# Altium schematic sheet CE842170260_SHEET1.SchDoc
size Tabloid; Revision: P; SheetNumber: 1; SheetTotal: 1; PageSetup: Record=PageOptions|CenterHorizontal=True|CenterVertical=True|PrintScale=0.75|XCorrection=1.00|YCorrection=1.00|PrintKind=0|BorderSize=5000000|LeftOffset=0|BottomOffset=0|Orientation=2|PaperLength=1000|PaperWidth=1000|Scale=100|PaperSource=7|PrintQuality=-4|MediaType=1|DitherType=10|PaperKind=A4|PrintScaleMode=1; Rule: PcbType=ProtelPcb
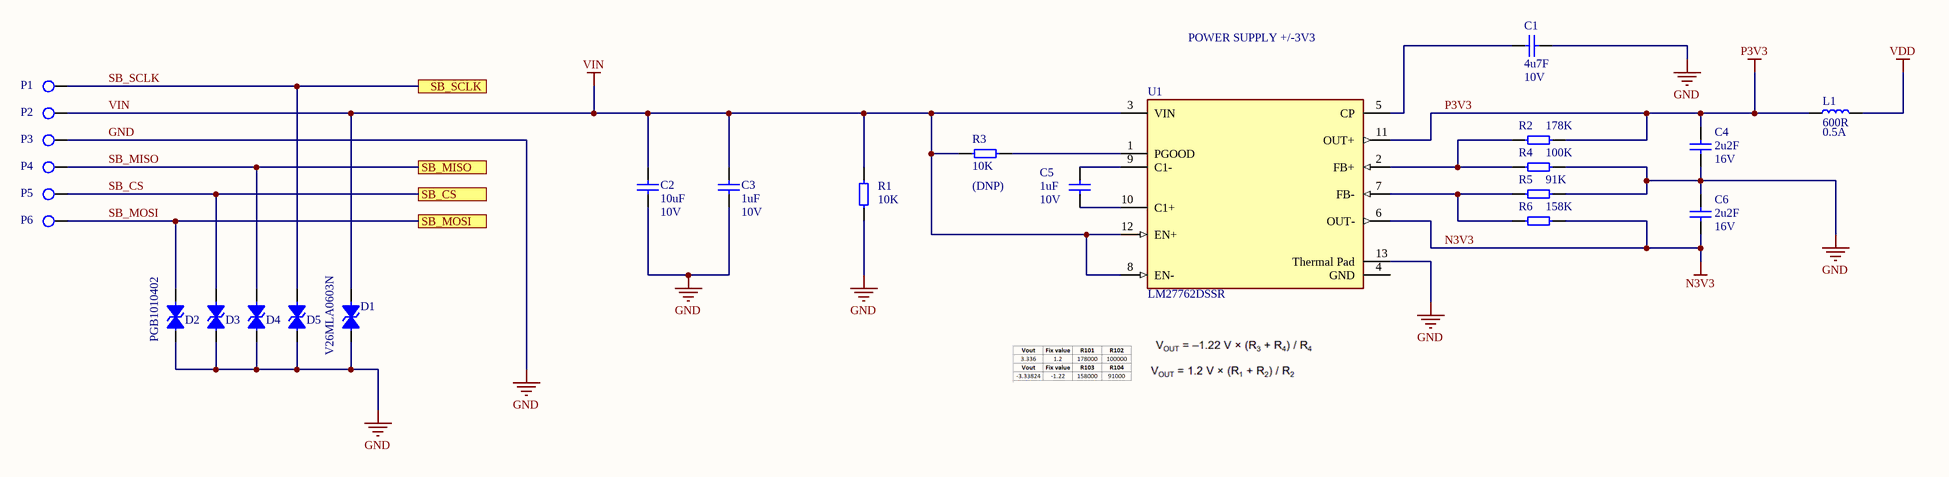
[diagram p0: CE842170260_SHEET1.SchDoc]

## Parts
C1  value 4u7F  Voltage: 10V  [C0603]  (hidden comment: KK/96159/2666)
C2  value 10uF  Voltage: 10V  [C0603]  (hidden comment: KK/96159/3701)
C3  value 1uF  Voltage: 10V  [C0603]  (hidden comment: KK/96159/2601)
C4  value 2u2F  Voltage: 16V  [C0603]  (hidden comment: KK/96159/3634)
C5  value 1uF  Voltage: 10V  [C0603]  (hidden comment: KK/96159/2601)
C6  value 2u2F  Voltage: 16V  [C0603]  (hidden comment: KK/96159/3634)
D1  MF_PartNumber: V26MLA0603N  [R0603]  (hidden comment: KK/95070/0035)
D2  MF_PartNumber: PGB1010402  [ESD0402]  (hidden comment: KK/95070/0036)
D3  KK/95070/0036  [ESD0402]  (value not drawn)
D4  KK/95070/0036  [ESD0402]  (value not drawn)
D5  KK/95070/0036  [ESD0402]  (value not drawn)
L1  value 600R  Power: 0.5A  [L0603]  (hidden comment: KK/97900/1033)
P1  TESTPAD1  [P0.8xH0.5]  (value not drawn)
P2  TESTPAD1  [P0.8xH0.5]  (value not drawn)
P3  TESTPAD1  [P0.8xH0.5]  (value not drawn)
P4  TESTPAD1  [P0.8xH0.5]  (value not drawn)
P5  TESTPAD1  [P0.8xH0.5]  (value not drawn)
P6  TESTPAD1  [P0.8xH0.5]  (value not drawn)
R1  value 10K  [R0603]  (hidden comment: KK/96059/0601)
R2  value 178K  [R0603]  (hidden comment: KK/96059/0725)
R3  value 10K  [R0603]  (hidden comment: KK/96059/0601)
R4  value 100K  [R0603]  (hidden comment: KK/96059/0701)
R5  value 91K  [R0603]  (hidden comment: KK/96059/1693)
R6  value 158K  [R0603]  (hidden comment: KK/96059/0720)
U1  MF_PartNumber: LM27762DSSR  [WSON-12]  (hidden comment: KK/95311/0117)

## Ports
SB_CS, SB_MISO, SB_MOSI, SB_SCLK

## Nets
GND: C1.2 C2.2 C3.2 C4.2 C6.1 D1.1 D2.1 D3.1 D4.1 D5.1 P3.1 R1.2 R4.2 R5.2 U1.13(Thermal_Pad)
N3V3: C6.2 R6.2 U1.6(OUT-)
P3V3: C4.1 L1.1 R2.2 U1.11(OUT+)
VDD: L1.2
VIN: C2.1 C3.1 D1.2 P2.1 R1.1 R3.1 U1.3(VIN) U1.8(EN-) U1.12(EN+)
SB_CS: D3.2 P5.1 ; port SB_CS
SB_MISO: D4.2 P4.1 ; port SB_MISO
SB_MOSI: D2.2 P6.1 ; port SB_MOSI
SB_SCLK: D5.2 P1.1 ; port SB_SCLK
NetC1_1: C1.1 U1.5(CP)
NetC5_1: C5.1 U1.9(C1-)
NetC5_2: C5.2 U1.10(C1+)
NetR2_1: R2.1 R4.1 U1.2(FB+)
NetR3_2: R3.2 U1.1(PGOOD)
NetR5_1: R5.1 R6.1 U1.7(FB-)

Not connected (* = marked no-connect by the designer): U1 4(GND)

## Notes on the sheet
- POWER SUPPLY +/-3V3
- (near R3) (DNP)
- Title:
- Designed:
- Date:
- PROPRIETARY & CONFIDENTIAL
- DO NOT COPY, WHOLE OR IN PART.
- Detail:
- Number:
- Rev:
- Checked:
- DO NOT DISTRIBUTE WITHOUT WRITTEN CONSENT.
- File:
- Sheet:
- of
- Approved:

## Library data of the parts
C1 = KK/96159/2666: CAPACITOR_4u7F_10%_10V_0603; ID: 165; Tolerance: 10%; PII_PartNumber: KK/96159/2666; Pins: 2
C2 = KK/96159/3701: CAPACITOR_10uF_10%_10V_0603; ID: 175; Tolerance: 10%; PII_PartNumber: KK/96159/3701; Pins: 2
C3 C5 = KK/96159/2601: CAPACITOR_1uF_+10%_10V_603; ID: 164; Tolerance: 10%; PII_PartNumber: KK/96159/2601; Pins: 2
C4 C6 = KK/96159/3634: CAPACITOR CERAMIC 0603 16V 10% X5R 2u2; ID: 569; PII_PartNumber: KK/96159/3634; Pins: 2; Tolerance: 10%
D1 = KK/95070/0035: TVS,SMD,LITTLEFUSE,V26MLA0603N[20-26V]; ID: 261; Voltage: 26V; Value: 34.5V; PII_PartNumber: KK/95070/0035; Pins: 2; Manufacturer: LITTLEFUSE; Temperature: -55°C +125°C
D2-D5 = KK/95070/0036: SUPPRESSOR ESD,SMD,0402,12VDC,LIF,PGB1010402; Manufacturer: LITTELFUSE; ID: 262; Voltage: 12V; PII_PartNumber: KK/95070/0036; Pins: 2
  D3-D5: MF_PartNumber: PGB1010402
L1 = KK/97900/1033: FERRIT BEADS 0603 600R 0.5A 25%; MF_PartNumber: 742863160; Manufacturer: WUERTH; ID: 158; PII_PartNumber: KK/97900/1033; Pins: 2; Tolerance: 25%; Temperature: -55 to +125C
P1-P6 = TESTPAD1: P0.8 X H0.5 X 0.9SM; Manufacturer: PCB MANUFACTURER; ID: 26; PII_PartNumber: TESTPAD1; MF_PartNumber: P0.8 X H0.5 X 0.9SM; Pins: 1
R1 R3 = KK/96059/0601: RESISTOR_10K_1%_0603J_63mW; ID: 1090; Tolerance: 1%; Power: 63mW; PII_PartNumber: KK/96059/0601; Pins: 2
R2 = KK/96059/0725: RESISTOR 0603 0.063W 0.1% 178K; ID: 1402; PII_PartNumber: KK/96059/0725; Pins: 2; Tolerance: 0.1%; Power: 0.063W
R4 = KK/96059/0701: RESISTOR_100K_1%_0603J_63mW; ID: 1111; Tolerance: 1%; Power: 63mW; PII_PartNumber: KK/96059/0701; Pins: 2
R5 = KK/96059/1693: RESISTOR 0603 0.063W 1% 91K; ID: 1396; PII_PartNumber: KK/96059/1693; Pins: 2; Tolerance: 1%; Power: 0.063W
R6 = KK/96059/0720: RESISTOR_158K_1%_0603J_63mW; ID: 1118; Tolerance: 1%; Power: 63mW; PII_PartNumber: KK/96059/0720; Pins: 2
U1 = KK/95311/0117: SWITCHING REGULATOR; Manufacturer: TEXAS INSTRUMENTS; Topology: Charge Pump; Min Output Voltage: 1.5V; Max Input Voltage: 5.5V; Synchronous Rectifier: No; Output Type: Adjustable; Output Current: 250mA; Min Input Voltage: 2.7V; Quiescent Current: 390uA; Switching Frequency: 2.3MHz; Max Output Voltage: 5V; ID: 104; Voltage: 2.7-5.5V; Lead Free: Lead Free; Min Operating Temperature: -40°C; Max Operating Temperature: 85°C; RoHS Compliant: Yes; Packaging: Tape and Reel; Mount: Surface Mount; Manufacturer Part Number: LM27762DSSR; PII_PartNumber: KK/95311/0117; Pins: 12; Power: 250mA; Temperature: -40 to +85C